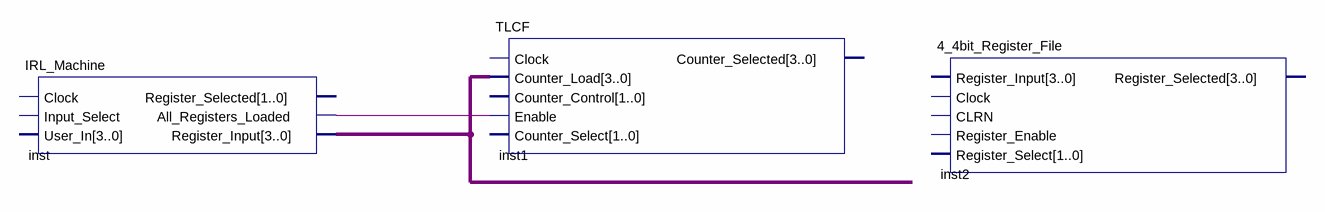
[diagram p0: schematic sheet]
// Quartus schematic IRL_RCC_Combo.bdf as structural Verilog: 3 symbols, 0 pins
module IRL_RCC_Combo (
);

  wire inst_all_registers_loaded;
  wire [3:0] inst_register_input;

  IRL_Machine inst (
    .All_Registers_Loaded(inst_all_registers_loaded), .Register_Input(inst_register_input));  // open: Clock, Input_Select, User_In, Register_Selected
  TLCF inst1 (
    .Counter_Load(inst_register_input), .Enable(inst_all_registers_loaded));  // open: Clock, Counter_Control, Counter_Select, Counter_Selected
  \4_4bit_Register_File  inst2 ();  // open: Register_Input, Clock, CLRN, Register_Enable, Register_Select, Register_Selected
endmodule
